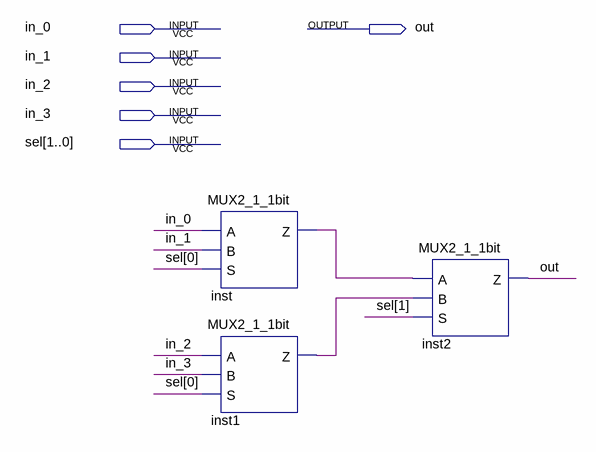
[diagram p0: schematic sheet]
// Quartus schematic MUX_4x2_1bit.bdf as structural Verilog: 3 symbols, 6 pins
module MUX_4x2_1bit (
  input  in_0,
  input  in_1,
  input  in_2,
  input  in_3,
  input  [1:0] sel,
  output out
);

  wire inst1_z, inst_z;

  MUX2_1_1bit inst (.A(in_0), .B(in_1), .S(sel[0]), .Z(inst_z));
  MUX2_1_1bit inst1 (.A(in_2), .B(in_3), .S(sel[0]), .Z(inst1_z));
  MUX2_1_1bit inst2 (.A(inst_z), .B(inst1_z), .S(sel[1]), .Z(out));
endmodule
